# EAGLE schematic FULLBRIDGE (EAGLE 9.6.2)
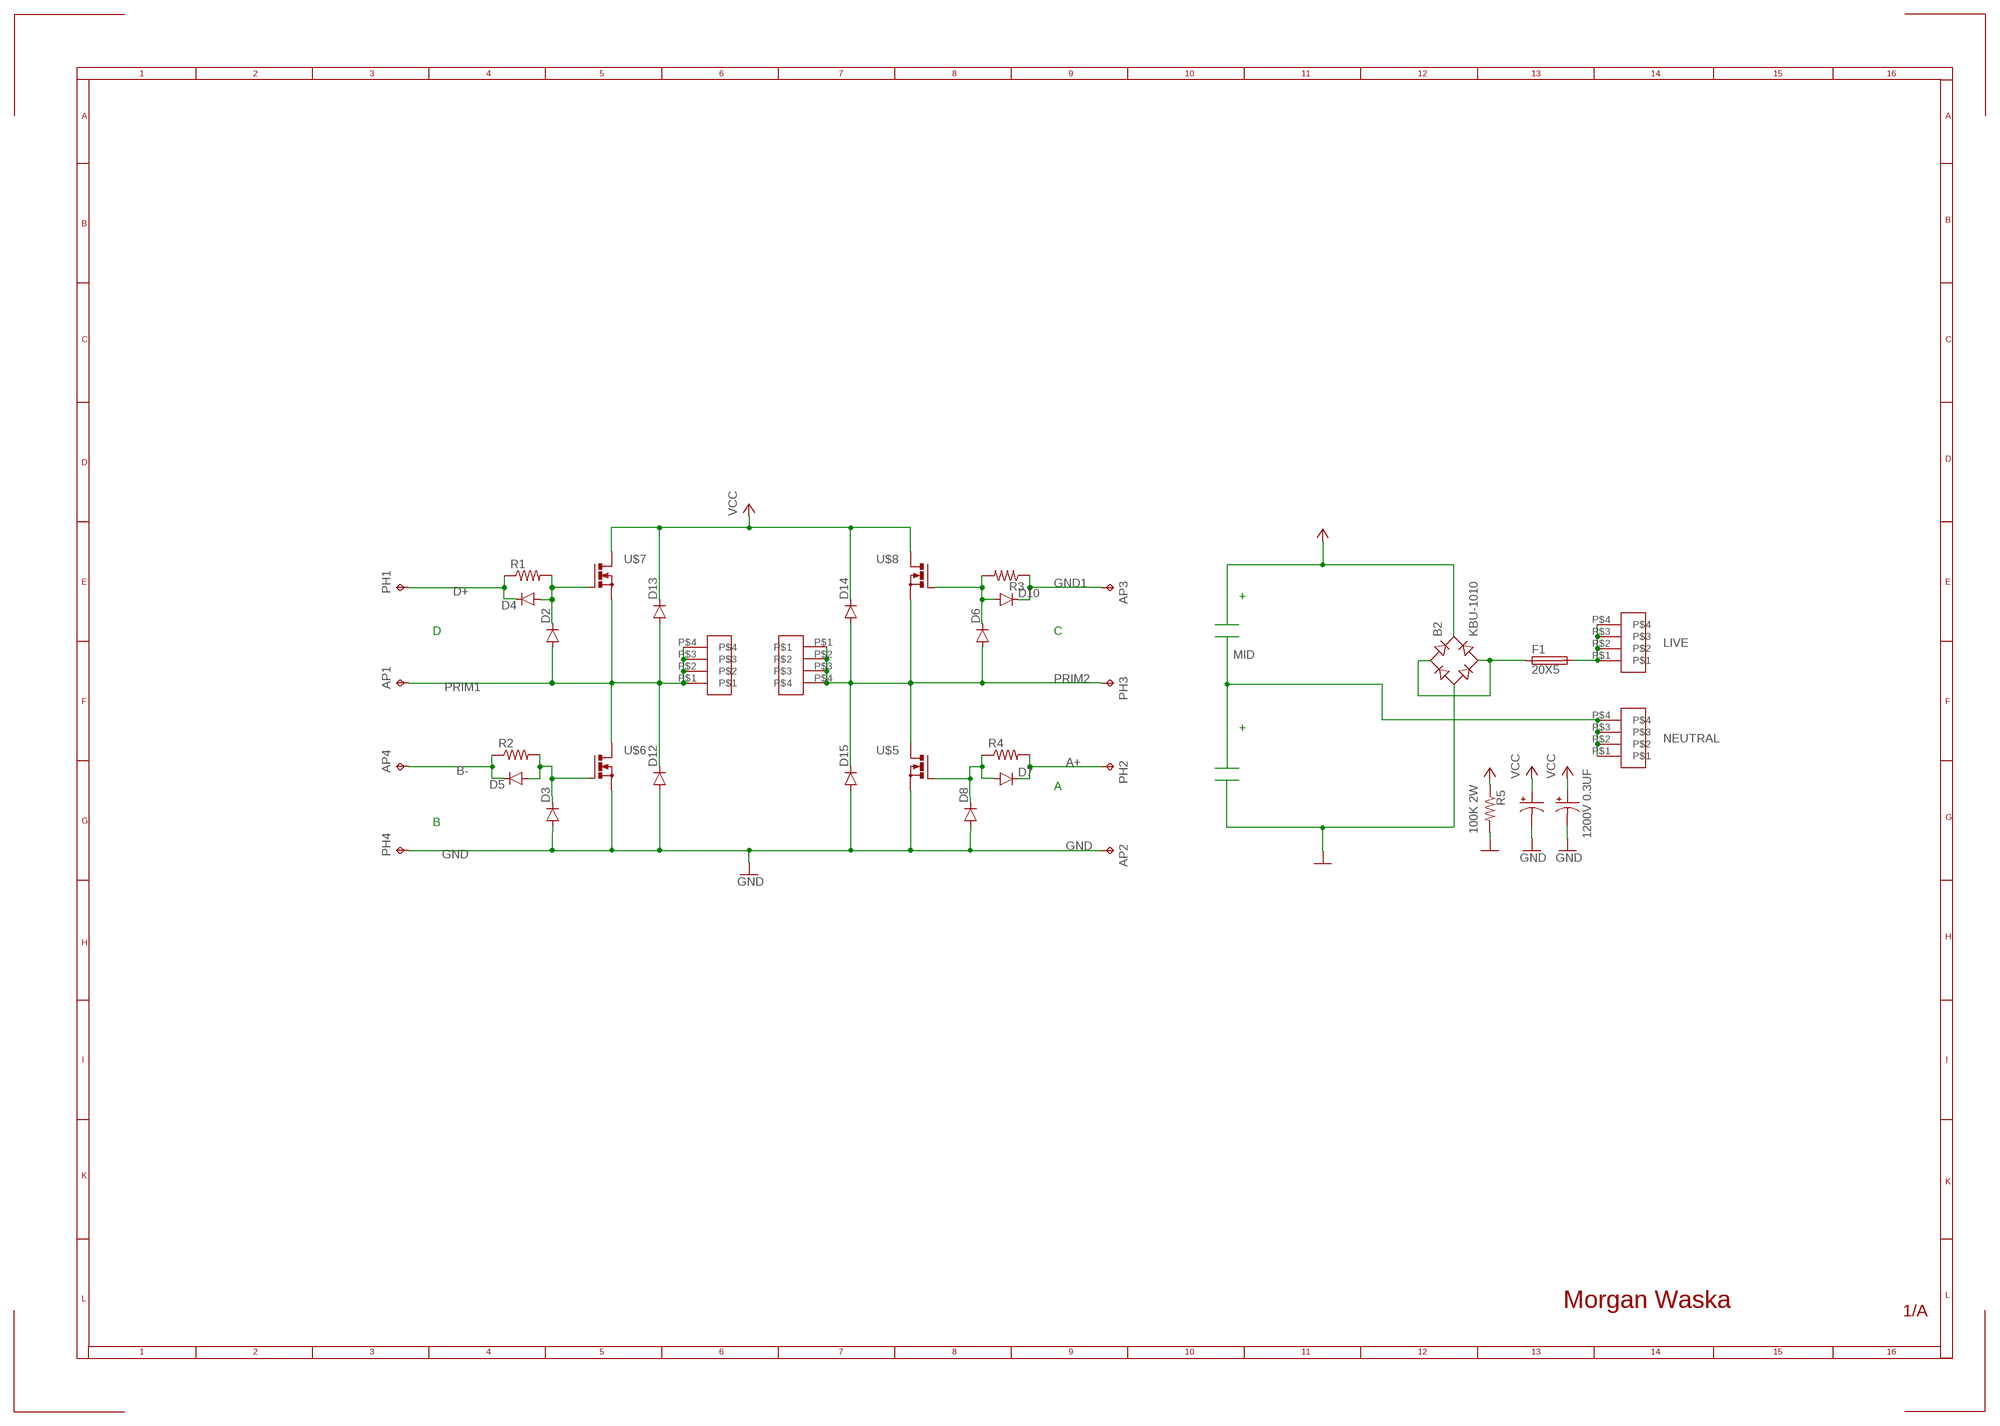
[diagram p0: schematic, sheet 1]

## Parts
AP1  TPTP20SQ  [TP20SQ]
AP2  TPTP20SQ  [TP20SQ]
AP3  TPTP20SQ  [TP20SQ]
AP4  TPTP20SQ  [TP20SQ]
B2  KBU-1010  RECTIFIER-KBU  [KBU]
D2  SMAJ26CA  DIODE-DO214AC  [DO214AC]
D3  SMAJ26CA  DIODE-DO214AC  [DO214AC]
D4  SS14-E3/5AT  DIODE-DO214AC  [DO214AC]
D5  SS14-E3/5AT  DIODE-DO214AC  [DO214AC]
D6  SMAJ26CA  DIODE-DO214AC  [DO214AC]
D7  SS14-E3/5AT  DIODE-DO214AC  [DO214AC]
D8  SMAJ26CA  DIODE-DO214AC  [DO214AC]
D10  SS14-E3/5AT  DIODE-DO214AC  [DO214AC]
D12  440V TVS  1N5060GP  [DO15-12]
D13  440V TVS  1N5060GP  [DO15-12]
D14  440V TVS  1N5060GP  [DO15-12]
D15  440V TVS  1N5060GP  [DO15-12]
F1  20X5  GSH15  [GSH15]
LIVE  KEY7788  [7788]
NEUTRAL  KEY7788  [7788]
PH1  TPTP20SQ  [TP20SQ]
PH2  TPTP20SQ  [TP20SQ]
PH3  TPTP20SQ  [TP20SQ]
PH4  TPTP20SQ  [TP20SQ]
R1  R-US_M1206  [M1206]
R2  R-US_M1206  [M1206]
R3  R-US_M1206  [M1206]
R4  R-US_M1206  [M1206]
R5  100K 2W  R-US_0411/12  [0411/12]
U$1  KEY7788  [7788]
U$2  KEY7788  [7788]
U$3  CHINEMKP  [CHINESEMKP]
U$4  CHINEMKP  [CHINESEMKP]
U$5  FGA60N65SMD_SMD  [TO247BH]
U$6  FGA60N65SMD_SMD  [TO247BH]
U$7  FGA60N65SMD_SMD  [TO247BH]
U$8  FGA60N65SMD_SMD  [TO247BH]

## Nets
A+ [POWER]: D7.C PH2.TP R4.2
B- [POWER]: AP4.TP D5.C R2.1
D+ [POWER]: D4.C PH1.TP R1.1
GND [POWER]: AP2.TP B2.- D3.A D8.A D12.A D15.A PH4.TP R5.2 U$3.P$2(-) U$4.P$2(-) U$5.S U$6.S
GND1 [POWER]: AP3.TP D10.C R3.1
MID [POWER]: NEUTRAL.P$1 NEUTRAL.P$2 NEUTRAL.P$3 NEUTRAL.P$4
N$4: F1.2 LIVE.P$1 LIVE.P$2 LIVE.P$3 LIVE.P$4
N$5 [POWER]: D6.C D10.A R3.2 U$8.G
N$9: B2.AC1 B2.AC2 F1.1
N$16 [POWER]: D3.C D5.A R2.2 U$6.G
N$19 [POWER]: D2.C D4.A R1.2 U$7.G
N$21 [POWER]: D7.A D8.C R4.1 U$5.G
PRIM1 [POWER]: AP1.TP D2.A D12.C D13.A U$1.P$1 U$1.P$2 U$1.P$3 U$1.P$4 U$6.D U$7.S
PRIM2 [POWER]: D6.A D14.A D15.C PH3.TP U$2.P$1 U$2.P$2 U$2.P$3 U$2.P$4 U$5.D U$8.S
VCC [POWER]: B2.+ D13.C D14.C R5.1 U$3.P$1(+) U$4.P$1(+) U$7.D U$8.D

## Notes on the sheet
- /Users/terrywaska/Desktop/WL.BMP
- /Users/terrywaska/Desktop/WL.BMP
- +
- D | C
- LIVE
- +
- NEUTRAL
- A
- B
- 1200V 0.3UF
- /Users/terrywaska/Desktop/WL.BMP
- Morgan Waska
- 1/A

## Library data of the parts
AP1-AP4 PH1-PH4 = testpad:TP: Test pad
B2 = rectifier:RECTIFIER-: Rectifier
D2-D8 D10 = diode:DIODE-: DIODE
D12-D15 = diode:1N5060GP: DIODE controlled avalanche rectifier
F1 = fuse:GSH15: FUSE HOLDER grid 15mm, 19649 Wickmann; MPN: 64900001039; OC_FARNELL: 1271673; OC_NEWARK: 02P0318
LIVE NEUTRAL U$1 U$2 = KETYSTONE 7788 M3 SCREW TERMINAL:KEY7788
R1-R5 = adafruit:R-US_: RESISTOR, American symbol
U$3 U$4 = CHINESE MKP HIBO:CHINEMKP
U$5-U$8 = FGA60N65SMD_SMD:FGA60N65SMD_SMD

## Net classes
1 POWER: width 0.254 mm, clearance 1.016 mm
2 PWR2: clearance 0.508 mm